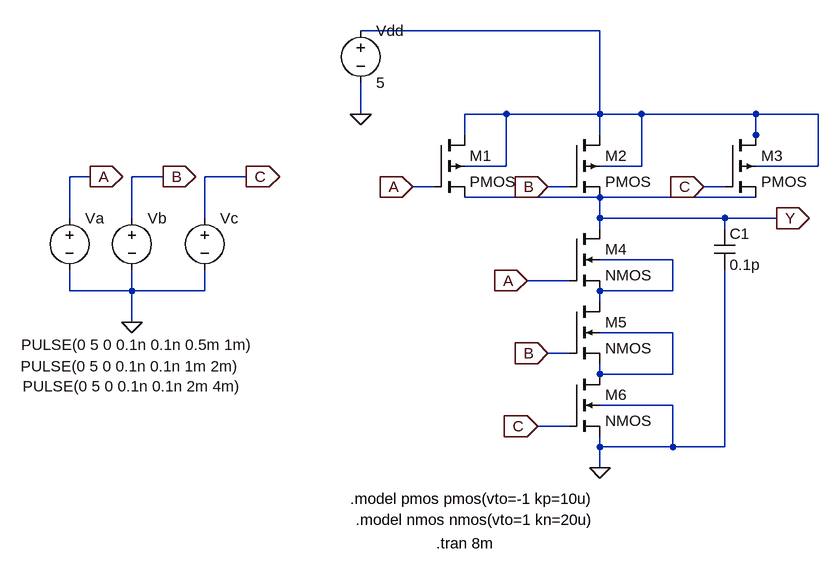
[diagram p0: schematic Exp 4 NAND.asc]
Exp 4 NAND.asc, the LTspice schematic file:
Version 4
SHEET 1 880 692
WIRE 416 -112 48 -112
WIRE 48 16 48 -32
WIRE 272 16 208 16
WIRE 416 16 416 -112
WIRE 416 16 272 16
WIRE 480 16 416 16
WIRE 656 16 480 16
WIRE 752 16 656 16
WIRE 208 48 208 16
WIRE 416 48 416 16
WIRE 656 48 656 16
WIRE 656 64 656 48
WIRE 272 96 272 16
WIRE 272 96 208 96
WIRE 480 96 480 16
WIRE 480 96 416 96
WIRE 752 96 752 16
WIRE 752 96 656 96
WIRE -368 112 -400 112
WIRE -256 112 -304 112
WIRE -128 112 -192 112
WIRE 160 128 128 128
WIRE 368 128 336 128
WIRE 608 128 576 128
WIRE 416 144 208 144
WIRE 656 144 416 144
WIRE -400 176 -400 112
WIRE -304 176 -304 112
WIRE -192 176 -192 112
WIRE 416 176 416 144
WIRE 608 176 416 176
WIRE 688 176 608 176
WIRE 416 192 416 176
WIRE 608 192 608 176
WIRE 528 240 416 240
WIRE 368 272 304 272
WIRE -400 288 -400 256
WIRE -304 288 -304 256
WIRE -304 288 -400 288
WIRE -192 288 -192 256
WIRE -192 288 -304 288
WIRE 528 288 528 240
WIRE 528 288 416 288
WIRE 416 304 416 288
WIRE -304 336 -304 288
WIRE 528 352 416 352
WIRE 368 384 336 384
WIRE 416 416 416 400
WIRE 528 416 528 352
WIRE 528 416 416 416
WIRE 528 464 416 464
WIRE 368 496 320 496
WIRE 416 528 416 512
WIRE 528 528 528 464
WIRE 528 528 416 528
WIRE 608 528 608 256
WIRE 608 528 528 528
WIRE 416 560 416 528
FLAG 688 176 Y
IOPIN 688 176 Out
FLAG 48 16 0
FLAG 128 128 A
IOPIN 128 128 In
FLAG 304 272 A
IOPIN 304 272 In
FLAG 336 128 B
IOPIN 336 128 In
FLAG 336 384 B
IOPIN 336 384 In
FLAG 576 128 C
IOPIN 576 128 In
FLAG 320 496 C
IOPIN 320 496 In
FLAG -304 336 0
FLAG -368 112 A
IOPIN -368 112 Out
FLAG -256 112 B
IOPIN -256 112 Out
FLAG -128 112 C
IOPIN -128 112 Out
FLAG 416 560 0
SYMBOL pmos4 160 48 R0
SYMATTR InstName M1
SYMATTR Value2 l=5u w=20u
SYMBOL pmos4 368 48 R0
SYMATTR InstName M2
SYMATTR Value2 l=5u w=20u
SYMBOL pmos4 608 48 R0
SYMATTR InstName M3
SYMATTR Value2 l=5u w=20u
SYMBOL nmos4 368 192 R0
SYMATTR InstName M4
SYMATTR Value2 l=5u w=10u
SYMBOL nmos4 368 304 R0
SYMATTR InstName M5
SYMATTR Value2 l=5u w=10u
SYMBOL nmos4 368 416 R0
SYMATTR InstName M6
SYMATTR Value2 l=5u w=10u
SYMBOL voltage 48 -128 R0
WINDOW 123 0 0 Left 0
WINDOW 39 0 0 Left 0
SYMATTR InstName Vdd
SYMATTR Value 5
SYMBOL voltage -400 160 R0
WINDOW 3 -74 211 Left 2
WINDOW 123 0 0 Left 0
WINDOW 39 0 0 Left 0
SYMATTR InstName Va
SYMATTR Value PULSE(0 5 0 0.1n 0.1n 0.5m 1m)
SYMBOL voltage -304 160 R0
WINDOW 3 -171 244 Left 2
WINDOW 123 0 0 Left 0
WINDOW 39 0 0 Left 0
SYMATTR InstName Vb
SYMATTR Value PULSE(0 5 0 0.1n 0.1n 1m 2m)
SYMBOL voltage -192 160 R0
WINDOW 3 -280 275 Left 2
WINDOW 123 0 0 Left 0
WINDOW 39 0 0 Left 0
SYMATTR InstName Vc
SYMATTR Value PULSE(0 5 0 0.1n 0.1n 2m 4m)
SYMBOL cap 592 192 R0
SYMATTR InstName C1
SYMATTR Value 0.1p
TEXT 32 608 Left 2 !.model pmos pmos(vto=-1 kp=10u)
TEXT 40 640 Left 2 !.model nmos nmos(vto=1 kn=20u)
TEXT 164 676 Left 2 !.tran 8m

The netlist it stands for:
* Exp 4 NAND.asc
M1 N001 A Y N001 PMOS l=5u w=20u
M2 N001 B Y N001 PMOS l=5u w=20u
M3 N001 C Y N001 PMOS l=5u w=20u
M4 Y A N002 N002 NMOS l=5u w=10u
M5 N002 B N003 N003 NMOS l=5u w=10u
M6 N003 C 0 0 NMOS l=5u w=10u
Vdd N001 0 5
Va A 0 PULSE(0 5 0 0.1n 0.1n 0.5m 1m)
Vb B 0 PULSE(0 5 0 0.1n 0.1n 1m 2m)
Vc C 0 PULSE(0 5 0 0.1n 0.1n 2m 4m)
C1 Y 0 0.1p
.model NMOS NMOS
.model PMOS PMOS
.lib standard.mos
.model pmos pmos(vto=-1 kp=10u)
.model nmos nmos(vto=1 kn=20u)
.tran 8m
.backanno
.end